# Altium schematic sheet Cap 100nF 16V.schdoc
size 43 x 29 mm
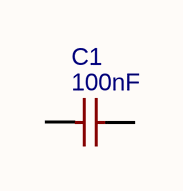
[diagram p0: Cap 100nF 16V.schdoc]

## Parts
C1  100nF  [C0603]

## Nets

Not connected (* = marked no-connect by the designer): C1 1 2

## Library data of the parts
C1 = 100nF: Manufacturer: muRata(村田); Manufacturer Part: GRM188R71C104KA01D; nameAlias: Value; Supplier: LCSC; Supplier Part: C45000; JLCPCB Part Class: Extended Part; spicePre: C; spiceSymbolName: GRM188R71C104KA01D